# EasyEDA Pro project ProDoc_P1_2025-09-09.epro

# Schematic ZL_C-TH_v1-P
Board Name: ZL-18650-v1; Create Date: 2025-08-22; Page Name: P1; Project Name: ZettaLights; Schematic Name: Sch-v1; Update Date: 2025-08-21; Company: EasyEDA.com; Page Size: A4; Version: V1.0
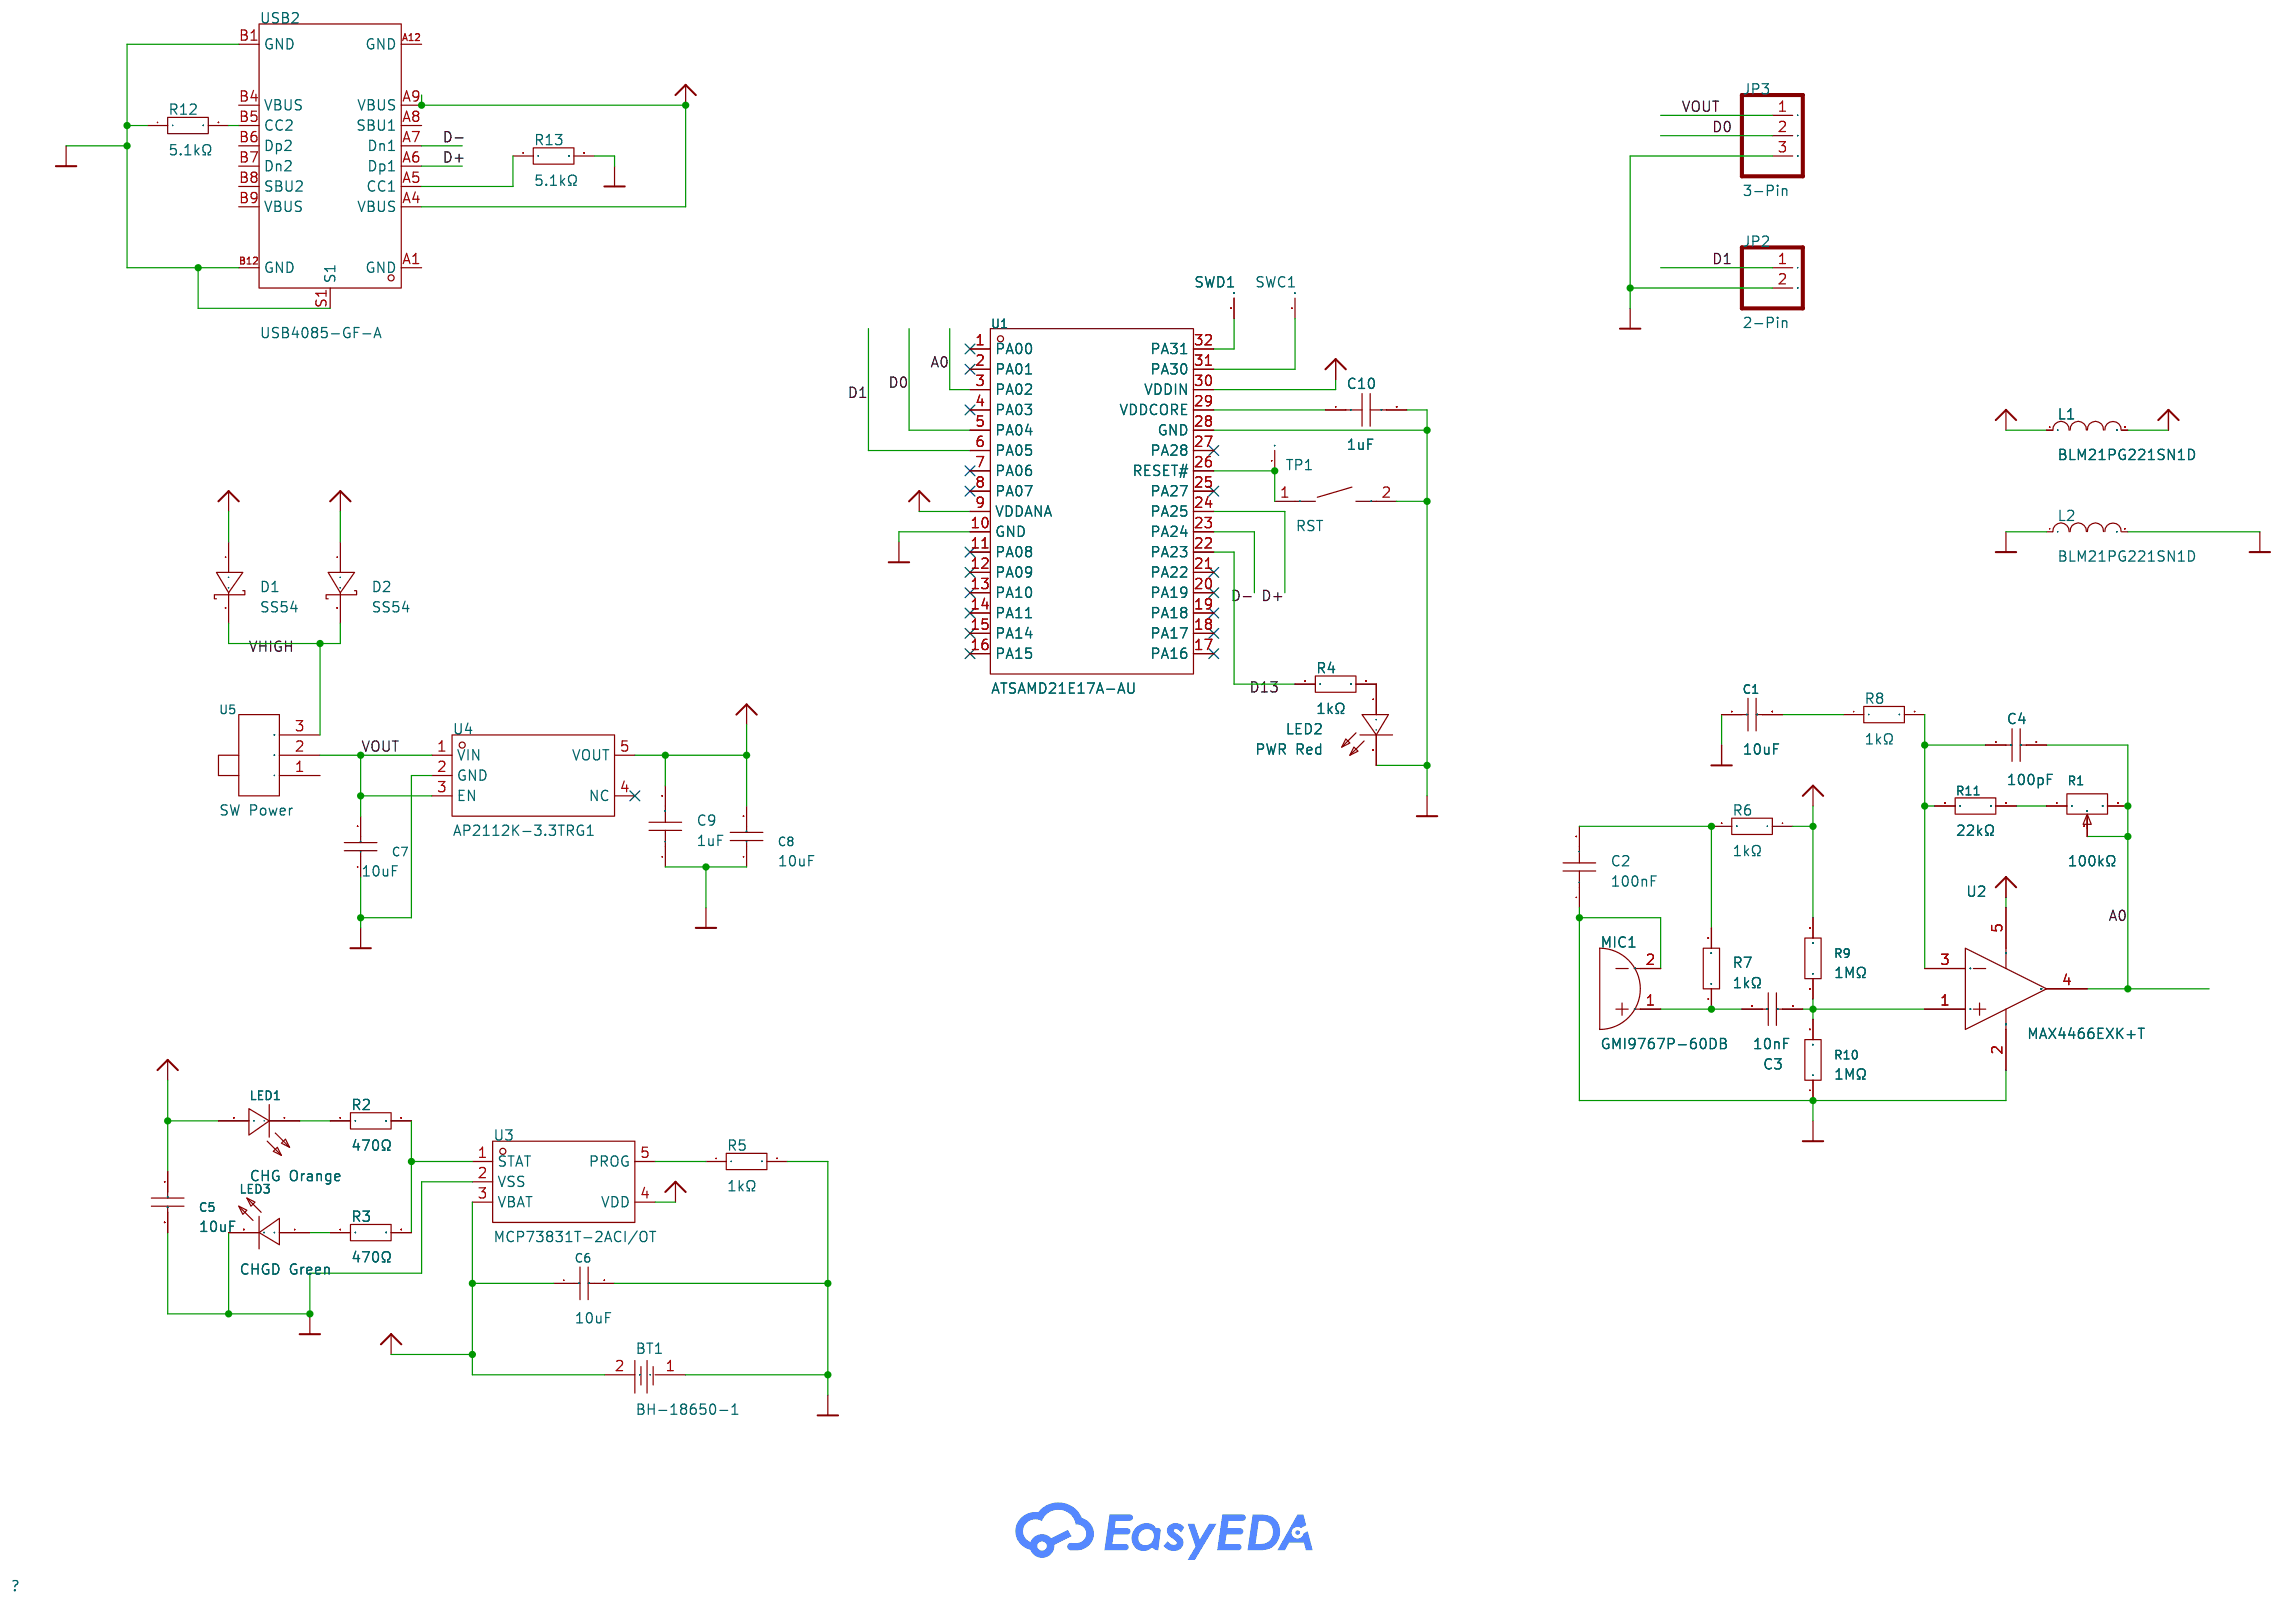
[diagram p0: schematic sheet]

## Parts
B1  SWC1  [CON_PAD_ROUND_1.02MM]
B2  SWD1  [CON_PAD_ROUND_1.02MM]
B3  TP1  [CON_PAD_ROUND_1.02MM]
BT1  BH-18650-1  [BAT-TH_BH-18650-A1AJ005]
C1  10uF  [C0805]
C2  100nF  [C0603]
C3  10nF  [C0603]
C4  100pF  [C0603]
C5  10uF  [C0805]
C6  10uF  [C0805]
C7  10uF  [C0805]
C8  10uF  [C0805]
C9  1uF  [C0805]
C10  1uF  [C0603]
D1  SS54  [SMA_L4.4-W2.8-LS5.4-R-RD]
D2  SS54  [SMA_L4.4-W2.8-LS5.4-R-RD]
JP2  2-Pin  [HDR-TH_2P-P2.54-V-M-2]
JP3  3-Pin  [HDR-TH_3P-P2.54-V-F_MF254V-11-03-0743]
L1  BLM21PG221SN1D  [L0805]
L2  BLM21PG221SN1D  [L0805]
LED1  CHG Orange  [LED0805-RD_ORANGE]
LED2  PWR Red  [LED0805-R-RD]
LED3  CHGD Green  [LED0805-R-RD]
MIC1  GMI9767P-60DB  [MIC-TH_BD9.7-P2.54-D0.8-L-FD]
R1  100kΩ  [RES-ADJ-SMD_3P-L4.5-W4.5-P2.30-BL-FS]
R2  470Ω  [R0603]
R3  470Ω  [R0603]
R4  1kΩ  [R0603]
R5  1kΩ  [R0603]
R6  1kΩ  [R0603]
R7  1kΩ  [R0603]
R8  1kΩ  [R0603]
R9  1MΩ  [R0402]
R10  1MΩ  [R0402]
R11  22kΩ  [R0402]
R12  5.1kΩ  [R0603]
R13  5.1kΩ  [R0603]
SW1  RST  [SW-SMD_L3.9-W3.0-P4.45]
U1  ATSAMD21E17A-AU  [TQFP-32_L7.0-W7.0-P0.80-LS9.0-BL]
U2  MAX4466EXK+T  [SC-70-5_L2.0-W1.3-P0.65-LS2.1-BR]
U3  MCP73831T-2ACI/OT  [SOT-23-5_L3.0-W1.7-P0.95-LS2.8-BL]
U4  AP2112K-3.3TRG1  [SOT-25-5_L2.9-W1.6-P0.95-LS2.8-BL]
U5  SW Power  [SW-TH_SS-12M12G5]
USB2  USB4085-GF-A  [USC-C-SMD_USB4085-GF-A]

## Library data of the parts
B1-B3 = PAD_TERMINAL
BT1 = BH-18650-1: Supplier Part: C49118395; Manufacturer: HanElectricity(瀚源); Supplier Footprint: 插件; JLCPCB Part Class: Extended Part; Datasheet: https://atta.szlcsc.com/upload/public/pdf/source/20250610/C17ABD4069470EE15CF9A6BA35C09002.pdf; Supplier: LCSC
C1 C5-C8 = CL21A106KOQNNNE: Capacitance:10uF Tolerance:±10% Tolerance:±10% Voltage Rating:16V Temperature Coefficient:X5R; LCSC Part Name: 10uF ±10% 16V; Supplier Part: C1713; Manufacturer: SAMSUNG(三星); Supplier Footprint: 0805; JLCPCB Part Class: Extended Part; Datasheet: https://item.szlcsc.com/datasheet/CL21A106KOQNNNE/2065.html; Supplier: LCSC; Tolerance: ±10%; Voltage Rating: 16V; Temperature Coefficient: X5R
C2 = CC0603KRX7R9BB104: Capacitance:100nF Tolerance:±10% Tolerance:±10% Voltage Rating:50V Temperature Coefficient:X7R; LCSC Part Name: 100nF ±10% 50V; Supplier Part: C14663; Manufacturer: YAGEO(国巨); Supplier Footprint: 0603; JLCPCB Part Class: Basic Part; Datasheet: https://atta.szlcsc.com/upload/public/pdf/source/20250214/096C4C206003071F5D32E5F0D8E7F8DF.pdf; Supplier: LCSC; Tolerance: ±10%; Voltage Rating: 50V; Temperature Coefficient: X7R
C3 = CL10B103KB8NNNC: Capacitance:10nF Tolerance:±10% Tolerance:±10% Voltage Rating:50V Temperature Coefficient:X7R; LCSC Part Name: 10nF ±10% 50V; Supplier Part: C1589; Manufacturer: SAMSUNG(三星); Supplier Footprint: 0603; JLCPCB Part Class: Extended Part; Datasheet: https://item.szlcsc.com/datasheet/CL10B103KB8NNNC/1941.html; Supplier: LCSC; Tolerance: ±10%; Voltage Rating: 50V; Temperature Coefficient: X7R
C4 = CL10C101JB8NNNC: Capacitance:100pF Tolerance:±5% Tolerance:±5% Voltage Rating:50V Temperature Coefficient:C0G; LCSC Part Name: 100pF ±5% 50V; Supplier Part: C14858; Manufacturer: SAMSUNG(三星); Supplier Footprint: 0603; JLCPCB Part Class: Basic Part; Datasheet: https://item.szlcsc.com/datasheet/CL10C101JB8NNNC/15530.html; Supplier: LCSC; Tolerance: ±5%; Voltage Rating: 50V; Temperature Coefficient: C0G
C9 = 0805B105K500NT_C215803: Capacitance:1uF Tolerance:±10% Tolerance:±10% Voltage Rating:50V Temperature Coefficient:X7R; LCSC Part Name: 1uF ±10% 50V; Supplier Part: C215803; Manufacturer: FH(风华); Manufacturer Part: 0805B105K500NT; Supplier Footprint: 0805; JLCPCB Part Class: Extended Part; Datasheet: https://atta.szlcsc.com/upload/public/pdf/source/20180530/C215803_D57791C2287FC18831C4E0C7838E6BEC.pdf; Supplier: LCSC; Tolerance: ±10%; Voltage Rating: 50V; Temperature Coefficient: X7R
C10 = CL10A105KB8NNNC: Capacitance:1uF Tolerance:±10% Tolerance:±10% Voltage Rating:50V Temperature Coefficient:X5R; LCSC Part Name: 1uF ±10% 50V; Supplier Part: C15849; Manufacturer: SAMSUNG(三星); Supplier Footprint: 0603; JLCPCB Part Class: Basic Part; Datasheet: https://item.szlcsc.com/datasheet/CL10A105KB8NNNC/16531.html; Supplier: LCSC; Tolerance: ±10%; Voltage Rating: 50V; Temperature Coefficient: X5R
D1 D2 = SS54_C22452: Diode Configuration:Independent Voltage - Forward(Vf@If):550mV@5A Voltage - DC Reverse(Vr):40V Current - Rectified:5A Reverse Leakage Current (Ir):1mA@40V Operating Junction Temperature Range:-55℃~+125℃ Operating Junction Temperature Range:-55℃~+125℃; LCSC Part Name: 电压:40V 电流:5A; Supplier Part: C22452; Manufacturer: MDD(辰达半导体); Supplier Footprint: SMA(DO-214AC); JLCPCB Part Class: Basic Part; Datasheet: https://item.szlcsc.com/datasheet/SS54/23178.html; Supplier: LCSC; Diode Configuration: Independent; Voltage - Forward(Vf@If): 550mV@5A; Voltage - DC Reverse(Vr): 40V; Current - Rectified: 5A; Reverse Leakage Current (Ir): 1mA@40V; Operating Junction Temperature Range: -55℃~+125℃
JP2 = microbuilder_HEADER-1X2_ROUND
JP3 = microbuilder_HEADER-1X3_76MIL
L1 L2 = BLM21PG221SN1D: Impedance @ Frequency:220Ω@100MHz Tolerance:±25% Tolerance:±25% DC Resistance:45mΩ Current Rating:2A Circuits:1; LCSC Part Name: 单路 0805磁珠 阻抗220Ω@100MHz; Supplier Part: C85840; Manufacturer: muRata(村田); Supplier Footprint: 0805; JLCPCB Part Class: Extended Part; Datasheet: https://atta.szlcsc.com/upload/public/pdf/source/20180326/C118443_3FAC30E9A4F0E6B81275543C61E0685E.pdf; Supplier: LCSC; Impedance @ Frequency: 220Ω@100MHz; Tolerance: ±25%; DC Resistance: 45mΩ; Current Rating: 2A; Circuits: 1
LED1 = NCD0805O1: Emitted Color:Orange Forward Voltage (VF):1.6V~2.6V Forward Voltage (VF):1.6V~2.6V Power Dissipation:65mW Forward Current:5mA Dominant Wavelength:589nm~610nm Dominant Wavelength:589nm~610nm Lens Color:无色透明透镜 Luminous Intensity:36mcd~100mcd Luminous Intens; Supplier Part: C84262; Manufacturer: 国星光电; Supplier Footprint: 0805; JLCPCB Part Class: Extended Part; Datasheet: https://atta.szlcsc.com/upload/public/pdf/source/20200820/C84262_0E6714C478D996B40DA4CAAE2B5C995C.pdf; Supplier: LCSC; Emitted Color: Orange; Forward Voltage (VF): 1.6V~2.6V; Power Dissipation: 65mW; Forward Current: 5mA; Dominant Wavelength: 589nm~610nm; Lens Color: 无色透明透镜; Luminous Intensity: 36mcd~100mcd; Viewing Angle: 130°; Operating Temperature: -30℃~+85℃
LED2 = NCD0805R1_C84256: Lamp Holder Type:- Emitted Color:Red Forward Voltage (VF):1.6V~2.6V Forward Voltage (VF):1.6V~2.6V Power Dissipation:65mW Forward Current:20mA Dominant Wavelength:615nm~630nm Dominant Wavelength:615nm~630nm Peak Wavelength:- Diode Configuration:独立二极管 Lens; LCSC Part Name: NCD0805R1; Supplier Part: C84256; Manufacturer: 国星光电; Manufacturer Part: NCD0805R1; Supplier Footprint: 0805; JLCPCB Part Class: Basic Part; Datasheet: https://atta.szlcsc.com/upload/public/pdf/source/20200820/C84256_F0A75A43B3EAD75808600A0514C76B99.pdf; Supplier: LCSC; Emitted Color: Red; Forward Voltage (VF): 1.6V~2.6V; Power Dissipation: 65mW; Forward Current: 20mA; Dominant Wavelength: 615nm~630nm; Diode Configuration: 独立二极管; Lens Color: 无色透明透镜; Luminous Intensity: 67mcd~195mcd; Viewing Angle: 130°; Operating Temperature: -30℃~+85℃
LED3 = NCD0805G1: Lamp Holder Type:- Illumination Color:Green Voltage - Forward(Vf):2.5V~3.6V Voltage - Forward(Vf):2.5V~3.6V Power(Watts):72mW Forward Current:20mA Wavelength - Dominant:525nm~537.5nm Wavelength - Dominant:525nm~537.5nm Peak Wavelength:- Diode Configuratio; Supplier Part: C84260; Manufacturer: 国星光电; Supplier Footprint: 0805; JLCPCB Part Class: Extended Part; Datasheet: https://item.szlcsc.com/datasheet/NCD0805G1/85429.html; Supplier: LCSC; Illumination Color: Green; Voltage - Forward(Vf): 2.5V~3.6V; Power(Watts): 72mW; Forward Current: 20mA; Wavelength - Dominant: 525nm~537.5nm; Luminous Intensity: 180mcd~400mcd; Viewing Angle: 130°; Operating Temperature: -30℃~+85℃
MIC1 = GMI9767P-60DB: LCSC Part Name: 全指向φ9.7*6.7mm 1.5V-10V 灵敏度-60db 低阻抗 针脚; Supplier Part: C234027; Manufacturer: INGHAi(赢海); Supplier Footprint: 插件,D=9.7mm; JLCPCB Part Class: Extended Part; Datasheet: https://atta.szlcsc.com/upload/public/pdf/source/20200113/C234027_CF3C55A4F5D8AE1134ACA865502492B2.pdf; Supplier: LCSC
R1 = 3314J-1-104E: Resistance:100kΩ Tolerance:±20% Tolerance:±20% Power(Watts):250mW Temperature Coefficient:±100ppm/℃ Temperature Coefficient:±100ppm/℃ Number of Turns:; LCSC Part Name: 100kΩ ±20%; Supplier Part: C51284; Manufacturer: BOURNS; Supplier Footprint: SMD,4.5x4.5mm; JLCPCB Part Class: Extended Part; Datasheet: https://item.szlcsc.com/datasheet/3314J-1-104E/52297.html; Supplier: LCSC; Tolerance: ±20%; Power(Watts): 250mW; Temperature Coefficient: ±100ppm/℃
R2 R3 = 0603WAF4700T5E: Type:Thick Film Resistor Resistance:470Ω Tolerance:±1% Tolerance:±1% Power(Watts):100mW Voltage-Supply(Max):75V Temperature Coefficient:±100ppm/℃ Temperature Coefficient:±100ppm/℃ Operating Temperature:-55℃~+155℃ Operating Temperature:-55℃~+155℃; LCSC Part Name: 470Ω ±1% 100mW 厚膜电阻; Supplier Part: C23179; Manufacturer: UNI-ROYAL(厚声); Supplier Footprint: 0603; JLCPCB Part Class: Basic Part; Datasheet: https://item.szlcsc.com/datasheet/0603WAF4700T5E/23906.html; Supplier: LCSC; Type: Thick Film Resistor; Tolerance: ±1%; Power(Watts): 100mW; Voltage-Supply(Max): 75V; Temperature Coefficient: ±100ppm/℃; Operating Temperature: -55℃~+155℃
R4-R8 = 0603WAF1001T5E: Type:Thick Film Resistors Resistance:1kΩ Tolerance:±1% Tolerance:±1% Power(Watts): Overload Voltage (Max): Temperature Coefficient:±100ppm/℃ Temperature Coefficient:±100ppm/℃ Operating Temperature Range:-55℃~+155℃ Operating Temperature Range:-55℃~+155℃; LCSC Part Name: 1kΩ ±1% 100mW 厚膜电阻; Supplier Part: C21190; Manufacturer: UNI-ROYAL(厚声); Supplier Footprint: 0603; JLCPCB Part Class: Basic Part; Datasheet: https://atta.szlcsc.com/upload/public/pdf/source/20200306/C422600_1E6D84923E4A46A82E41ADD87F860B5C.pdf; Supplier: LCSC; Type: Thick Film Resistors; Tolerance: ±1%; Temperature Coefficient: ±100ppm/℃; Operating Temperature Range: -55℃~+155℃
R9 R10 = 0402WGF1004TCE: Type:Thick Film Resistor Resistance:1MΩ Tolerance:±1% Tolerance:±1% Power(Watts):62.5mW Voltage-Supply(Max):50V Temperature Coefficient:±100ppm/℃ Temperature Coefficient:±100ppm/℃ Operating Temperature:-55℃~+155℃ Operating Temperature:-55℃~+155℃; LCSC Part Name: 1MΩ ±1% 62.5mW 厚膜电阻; Supplier Part: C26083; Manufacturer: UNI-ROYAL(厚声); Supplier Footprint: 0402; JLCPCB Part Class: Basic Part; Datasheet: https://item.szlcsc.com/datasheet/0402WGF1004TCE/26826.html; Supplier: LCSC; Type: Thick Film Resistor; Tolerance: ±1%; Power(Watts): 62.5mW; Voltage-Supply(Max): 50V; Temperature Coefficient: ±100ppm/℃; Operating Temperature: -55℃~+155℃
R11 = 0402WGF2202TCE: Type:Thick Film Resistor Resistance:22kΩ Tolerance:±1% Tolerance:±1% Power(Watts):62.5mW Voltage-Supply(Max):50V Temperature Coefficient:±100ppm/℃ Temperature Coefficient:±100ppm/℃ Operating Temperature:-55℃~+155℃ Operating Temperature:-55℃~+155℃; LCSC Part Name: 22kΩ ±1% 62.5mW 厚膜电阻; Supplier Part: C25768; Manufacturer: UNI-ROYAL(厚声); Supplier Footprint: 0402; JLCPCB Part Class: Basic Part; Datasheet: https://item.szlcsc.com/datasheet/0402WGF2202TCE/26511.html; Supplier: LCSC; Type: Thick Film Resistor; Tolerance: ±1%; Power(Watts): 62.5mW; Voltage-Supply(Max): 50V; Temperature Coefficient: ±100ppm/℃; Operating Temperature: -55℃~+155℃
R12 R13 = 0603WAF5101T5E: Type:Thick Film Resistor Resistance:5.1kΩ Tolerance:±1% Tolerance:±1% Power(Watts):100mW Voltage-Supply(Max):75V Temperature Coefficient:±100ppm/℃ Temperature Coefficient:±100ppm/℃ Operating Temperature:-55℃~+155℃ Operating Temperature:-55℃~+155℃; LCSC Part Name: 5.1kΩ ±1% 100mW 厚膜电阻; Supplier Part: C23186; Manufacturer: UNI-ROYAL(厚声); Supplier Footprint: 0603; JLCPCB Part Class: Basic Part; Datasheet: https://item.szlcsc.com/datasheet/0603WAF5101T5E/23913.html; Supplier: LCSC; Type: Thick Film Resistor; Tolerance: ±1%; Power(Watts): 100mW; Voltage-Supply(Max): 75V; Temperature Coefficient: ±100ppm/℃; Operating Temperature: -55℃~+155℃
SW1 = TS-1088-AR02016: Circuit:SPST Actuator Style:Round Button Operating Force:160gf Mounting Style:Brick nogging Switch Length:4mm Switch Width:3mm Switch Height:2mm Strike Gundam:不带 Contact Current:50mA Voltage Rating (DC):12V Insulation Resistance:100MΩ Actuator/Cap Color:B; LCSC Part Name: 4*3*2mm 立贴 轻触开关; Supplier Part: C720477; Manufacturer: XUNPU(讯普); Supplier Footprint: SMD; JLCPCB Part Class: Basic Part; Datasheet: https://atta.szlcsc.com/upload/public/pdf/source/20200810/C720475_60D09DD6C54279ADDB2DC25100F1CC11.pdf; Supplier: LCSC; Circuit: SPST; Actuator Style: Round Button; Operating Force: 160gf; Mounting Style: Brick nogging; Switch Length: 4mm; Switch Width: 3mm; Switch Height: 2mm; Strike Gundam: 不带; Contact Current: 50mA; Voltage Rating (DC): 12V; Insulation Resistance: 100MΩ; Actuator/Cap Color: Black; Pin Style: SMDSplicing; Mechanical Life: 10万次; Operating Temperature: -30℃~+80℃
U1 = ATSAMD21E17A-AU_C1337408: CPU Core:ARM-MSeries Program Storage Size:128KB GPIO Ports Number:26 Operating Voltage Range:1.62V~3.6V Operating Voltage Range:1.62V~3.6V CPU Maximum Speed:48MHz Program Memory Type:FLASH Operating Temperature Range:-40℃~+85℃ Operating Temperature Range:; Supplier Part: C1337408; Manufacturer: MICROCHIP(美国微芯); Supplier Footprint: TQFP-32(7x7); JLCPCB Part Class: Extended Part; Datasheet: https://atta.szlcsc.com/upload/public/pdf/source/20210630/C1337408_D7AD24EDFE5C784834B5DBCBF7215557.pdf; Supplier: LCSC; CPU Core: ARM-MSeries; Program Storage Size: 128KB; GPIO Ports Number: 26; Operating Voltage Range: 1.62V~3.6V; CPU Maximum Speed: 48MHz; Program Memory Type: FLASH; Operating Temperature Range: -40℃~+85℃; ADC (Bit): 12bit; DAC (Bit): 10bit; Universal Serial Bus: 有; Peripheral/Function: PWM；PWM; Watchdog: 有; Low-Voltage Detect: 有; Direct Memory Access: 有; Internal Oscillator: 有
U2 = MAX4466EXK+T: Class:- Speaker Channels:Monaural Output Power:- Voltage - Supply:2.4V~5.5V Voltage - Supply:2.4V~5.5V Quiescent Current:- Operating Temperature:-40℃~+85℃ Operating Temperature:-40℃~+85℃; LCSC Part Name: 低成本、微功耗、SC70/SOT23-8封装、麦克风前置放大器，可完全关断; Supplier Part: C7456762; Manufacturer: ADI(亚德诺)/MAXIM(美信); Supplier Footprint: SC-70-5; JLCPCB Part Class: Extended Part; Datasheet: https://atta.szlcsc.com/upload/public/pdf/source/20230919/1C26F795883D5A758FE0EDB1A75C39BE.pdf; Supplier: LCSC; Speaker Channels: Monaural; Voltage - Supply: 2.4V~5.5V; Operating Temperature: -40℃~+85℃
U3 = MCP73831T-2ACI/OT: The Chip Type:- Voltage - Supply:3.75V~6V Voltage - Supply:3.75V~6V Charge Current - Max:- Charging Saturation Voltage:4.2V Type of Battery:Lithium-ion/Polymer Number of Cells:1 Number of Cells:1 Operating Temperature:-40℃~+85℃ Operating Temperature:-40℃~; Supplier Part: C424093; Manufacturer: MICROCHIP(美国微芯); Supplier Footprint: SOT-23-5; JLCPCB Part Class: Extended Part; Datasheet: https://item.szlcsc.com/datasheet/MCP73831T-2ACI%252FOT/417116.html; Supplier: LCSC; Voltage - Supply: 3.75V~6V; Charging Saturation Voltage: 4.2V; Type of Battery: Lithium-ion/Polymer; Number of Cells: 1; Operating Temperature: -40℃~+85℃
U4 = AP2112K-3.3TRG1: Output Type:Fixed Voltage - Supply:6V Output Voltage:3.3V Output Voltage:3.3V Output Current:600mA Power Supply Rejection Ratio (PSRR):65dB@(1kHz) Voltage Dropout:250mV@(600mA) standby current:55uA Noise:50uVrms Features:Enable；Over Temperature Protection; LCSC Part Name: 输入6V 输出3.3V 600mA; Supplier Part: C51118; Manufacturer: DIODES(美台); Supplier Footprint: SOT-25-5; JLCPCB Part Class: Extended Part; Datasheet: https://item.szlcsc.com/datasheet/AP2112K-3.3TRG1/52131.html; Supplier: LCSC; Output Type: Fixed; Voltage - Supply: 6V; Output Voltage: 3.3V; Output Current: 600mA; Power Supply Rejection Ratio (PSRR): 65dB@(1kHz); Voltage Dropout: 250mV@(600mA); standby current: 55uA; Noise: 50uVrms; Features: Enable；Over Temperature Protection；Over Current Protection; Operating Temperature: -40℃~+85℃@(Ta); Output Configuration: Positive; Number of Outputs: 1
U5 = SS-12M12G5: Circuit:SPDT Actuator Style:Rectangular columnar Pin Style:PCPin Switch Length:13.2mm Switch Width:7.2mm Switch Height:6.6mm Mounting Style:Right-Angle Actuator Color:Black Current Rating (DC):6A Voltage Rating (DC):120V Current Rating (AC):6A Voltage Rat; LCSC Part Name: 柄长5mm 弯插双档 滑动开关; Supplier Part: C2884789; Manufacturer: XKB Connectivity(中国星坤); Supplier Footprint: 插件; JLCPCB Part Class: Extended Part; Datasheet: https://atta.szlcsc.com/upload/public/pdf/source/20211009/F44B934214AE410D67AA0A05A88FD376.pdf; Supplier: LCSC; Circuit: SPDT; Actuator Style: Rectangular columnar; Pin Style: PCPin; Switch Length: 13.2mm; Switch Width: 7.2mm; Switch Height: 6.6mm; Mounting Style: Right-Angle; Actuator Color: Black; Current Rating (DC): 6A; Voltage Rating (DC): 120V; Current Rating (AC): 6A; Voltage Rating (AC): 120V; Mechanical Life: 1万次; Operating Temperature: -40℃~+85℃
USB2 = USB4085-GF-A_C7095263: Supplier Part: C7095263; Manufacturer: GCT; Supplier Footprint: 插件; JLCPCB Part Class: Extended Part; Datasheet: https://atta.szlcsc.com/upload/public/pdf/source/20240130/13BD148244FAEE722A2AF59585DC5F07.pdf; Supplier: LCSC

## Nets
3.3V: C8.2 C9.2 L1.1 U1.9(VDDANA) U1.30(VDDIN) U4.5(VOUT)
AGND: C1.1 C2.1 L2.2 MIC1.2 R10.1 U2.2(GND)
AVCC: L1.2 R6.1 R9.2 U2.5(VCC)
GND: BT1.1 C5.2 C6.2 C7.1 C8.1 C9.1 C10.2 JP2.2 JP3.3 L2.1 LED2.2(-) LED3.2(K) R5.2 R12.1 R13.2 SW1.2 U1.10(GND) U1.28(GND) U3.2(VSS) U4.2(GND) USB2.B1(GND) USB2.B12(GND) USB2.S1
VBAT: BT1.2 C6.1 D1.1(A) U3.3(VBAT)
VBUS: C5.1 D2.1(A) LED1.2(+) U3.4(VDD) USB2.A4(VBUS) USB2.A9(VBUS)
A0: C4.2 R1.2 R1.3 U1.3(PA02) U2.4(OUT)
D0: JP3.2 U1.5(PA04)
D1: JP2.1 U1.6(PA05)
D13: R4.1 U1.22(PA23)
D+: U1.24(PA25) USB2.A6(Dp1)
D-: U1.23(PA24) USB2.A7(Dn1)
VHIGH: D1.2(K) D2.2(K) U5.3
VOUT: C7.2 JP3.1 U4.1(VIN) U4.3(EN) U5.2
Net-(B1-P): B1.P U1.31(PA30)
Net-(B2-P): B2.P U1.32(PA31)
Net-(B3-P): B3.P SW1.1 U1.26(RESET#)
Net-(C1-2): C1.2 R8.1
Net-(C2-2): C2.2 R6.2 R7.2
Net-(C3-1): C3.1 MIC1.1 R7.1
Net-(C3-2): C3.2 R9.1 R10.2 U2.1(IN+)
Net-(C4-1): C4.1 R8.2 R11.1 U2.3(IN-)
Net-(C10-1): C10.1 U1.29(VDDCORE)
Net-(LED1-1): LED1.1(-) R2.1
Net-(LED2-1): LED2.1(+) R4.2
Net-(LED3-1): LED3.1(A) R3.1
Net-(R1-1): R1.1 R11.2
Net-(R2-2): R2.2 R3.2 U3.1(STAT)
Net-(R5-1): R5.1 U3.5(PROG)
Net-(R12-2): R12.2 USB2.B5(CC2)
Net-(R13-1): R13.1 USB2.A5(CC1)

Not connected (* = marked no-connect by the designer): U1 1(PA00)* 2(PA01)* 4(PA03)* 7(PA06)* 8(PA07)* 11(PA08)* 12(PA09)* 13(PA10)* 14(PA11)* 15(PA14)* 16(PA15)* 17(PA16)* 18(PA17)* 19(PA18)* 20(PA19)* 21(PA22)* 25(PA27)* 27(PA28)*; U4 4(NC)*; U5 1; USB2 A1(GND) A8(SBU1) A12(GND) B4(VBUS) B6(Dp2) B7(Dn2) B8(SBU2) B9(VBUS)
